# Altium project Suscoder.PrjPcb
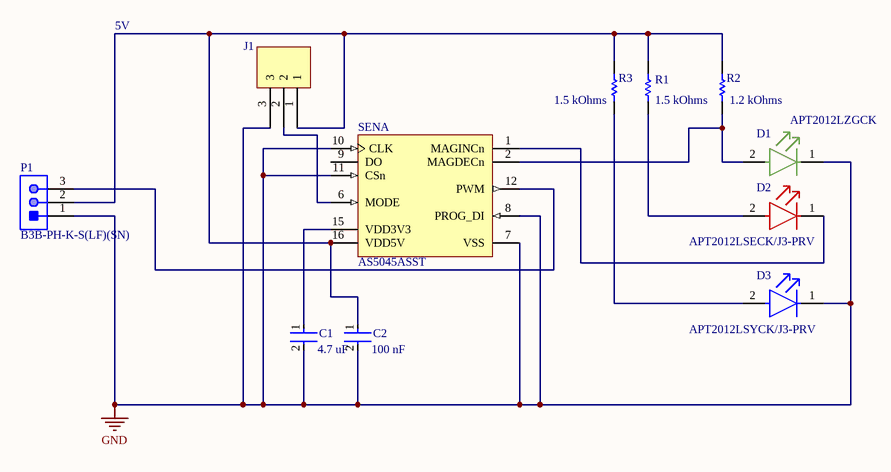
[diagram p0: SuscoderSCH.SchDoc]
1 sheet, 11 parts. Net scope: global (net labels, ports and power ports of the same name join across sheets).
Board file: SuscoderPCB.PcbDoc

## Sheet SuscoderSCH.SchDoc
size A; SheetNumber: 1; SheetTotal: 1

### Parts
C1  Capacitance: 4.7 uF  [FP-CC0805-0_85-MFG]  (hidden comment: CC0805KKX7R7BB475)
C2  Capacitance: 100 nF  [FP-CC0805-0_85-MFG]  (hidden comment: CC0805KRX7R7BB104)
D1  APT2012LZGCK  [FP-APT2012LSYCK-J3-PRV-MFG]
D2  APT2012LSECK/J3-PRV  [FP-APT2012LSYCK-J3-PRV-MFG]
D3  APT2012LSYCK/J3-PRV  [FP-APT2012LSYCK-J3-PRV-MFG]
J1  Tri-Pad Jumper  [Tri-Pad Jumper-Footprint-1]  (value not drawn)
P1  B3B-PH-K-S(LF)(SN)  [JST-B3B-PH-K-S-3_V]
R1  Resistance: 1.5 kOhms  [RESC2013X70X40ML20T20]  (hidden comment: ERJ-6ENF1501V)
R2  Resistance: 1.2 kOhms  [RESC2013X70X40ML20T20]  (hidden comment: ERJ6ENF1201V)
R3  Resistance: 1.5 kOhms  [RESC2013X70X40ML20T20]  (hidden comment: ERJ-6ENF1501V)
SEN  AS5045ASST  [AMS-SSOP-16-6200X5300DE_A_N]  (part A of 2)

### Nets
GND: C1.2 C2.2 D1.1(C) D3.1(C) J1.3 P1.1 SEN.7(VSS) SEN.8(PROG_DI) SEN.10(CLK) SEN.11(CSn)
NetC1_1: C1.1 SEN.15(VDD3V3)
NetC2_1: C2.1 J1.1 P1.2 R1.2 R2.2 R3.2 SEN.16(VDD5V)
NetD1_2: D1.2(A) R2.1 SEN.2(MAGDECn)
NetD2_1: D2.1(C) SEN.1(MAGINCn)
NetD2_2: D2.2(A) R1.1
NetD3_2: D3.2(A) R3.1
NetJ1_2: J1.2 SEN.6(MODE)
NetP1_3: P1.3 SEN.12(PWM)

Not connected (* = marked no-connect by the designer): SEN 9(DO)

### Notes on the sheet
- 5V

### Library data of the parts
C1 = CMP-03422-000207-1: CAP CER 4.7UF 16V X7R 0805; Manufacturer: Yageo; Tolerance: 0.1; Material: Ceramic; Footprint Url: http://www.yageo.com/exep/pages/download/literatures/UPY-C_GEN_24.pdf; Device Class L3: Ceramic Capacitors; Temperature: -30°C to +85°C; Device Class L2: Capacitors; Automotive: No; Digikey Description: CAP CER 4.7UF 16V X7R 0805; Temperature Range High: +85°C; Lead Free: Yes; Mouser Description: Multilayer Ceramic Capacitors MLCC - SMD/SMT 4.7M pF 10% 16 Volts; Temperature Characteristic: X7R; Height: 0.95mm; Device Class L1: Passive Components; ComponentLink2Description: Datasheet; Category: Cap; Octopart: https://octopart.com/cc0805kkx7r7bb475-yageo-34429188; Temperature Range Low: -30°C; Manufacturer Part Number: CC0805KKX7R7BB475; Package: CC0805-0.85; Ipc Land Pattern Name: CAPC200125X85; RoHS: TRUE; Value: 4.7 uF; ComponentLink2URL: http://www.yageo.com/documents/recent/UPY-GPHC_Y5V_6.3V-to-50V_8.pdf; Voltage Rating: 16 V
C2 = CMP-1036-04402-6: CAP CER 0.1UF 16V X7R 0805; Manufacturer: Yageo; Material: Ceramic; Tolerance: 0.1; Value: 100 nF; Manufacturer Part Number: CC0805KRX7R7BB104; Temperature: -30°C to +85°C; Lead Free: Yes; Footprint Url: http://www.yageo.com/exep/pages/download/literatures/UPY-C_GEN_24.pdf; Voltage Rating: 16 V; Package: CC0805-0.85; RoHS: TRUE; Digikey Description: CAP CER 0.1UF 16V X7R 0805; Category: Cap; Octopart: https://octopart.com/cc0805krx7r7bb104-yageo-39467769; Device Class L3: Ceramic Capacitors; ComponentLink2URL: http://www.yageo.com/documents/recent/UPY-GPHC_Y5V_6.3V-to-50V_8.pdf; Temperature Range Low: -30°C; Mouser Description: Multilayer Ceramic Capacitors MLCC - SMD/SMT 100nF 16V X7R 10%; Automotive: No; Device Class L2: Capacitors; Height: 0.95mm; ComponentLink2Description: Datasheet; Temperature Characteristic: X7R; Ipc Land Pattern Name: CAPC200125X85; Device Class L1: Passive Components; Temperature Range High: +85°C
D1 = CMP-007-00039-1: 2.0X1.2mm Low Current Green SMD LED; Water Clear; 525nm; 140° Viewing Angle
D2 = CMP-007-00037-1: 2.0X1.2mm Low Current Red SMD LED; Water Clear; 625nm; 140° Viewing Angle
D3 = CMP-44529-000012-1: LED YELLOW CLEAR 2SMD; Manufacturer: Kingbright; Peak Emmision Wavelength: 590nm; Luminous Intensity: 25mcd; Led Orientation: Top View; Viewing Angle: 140°; Reverse Voltage: 5V; Power Dissipation: 75mW; Forward Voltage: 1.85V; Max Junction Temp: +115°C; Forward Current: 2mA; Temperature Range Low: -40°C; Height: 0.85mm; ComponentLink2Description: Datasheet; Wavelength: 590nm; Category: Diode; Mouser Description: Standard LEDs - SMD 2.0X1.2MM LOW CRNT; RoHS: TRUE; Package: 0; Lead Free: Yes; Automotive: No; Octopart: https://octopart.com/apt2012lsyck%2Fj3-prv-kingbright-56784114; Colour: Yellow; Device Class L2: LEDs; Temperature: -40°C to +85°C; Device Class L1: Optoelectronics; Manufacturer Part Number: APT2012LSYCK/J3-PRV; ComponentLink2URL: http://www.kingbrightusa.com/images/catalog/SPEC/APT2012LSYCK-J3-PRV.pdf; Digikey Description: LED YELLOW CLEAR 2SMD; Temperature Range High: +85°C; Device Class L3: unset
J1 = CMP-00000-1: A jumper with 3 pads.
P1 = CMP-2000-05164-1: Male Header, Pitch 2 mm, 1 x 3 Position, Height 6 mm, Tail Length 3.4 mm, -25 to 85 degC, RoHS, Bulk; Manufacturer: JST; Style/Orientation: StraightHeader/Plug; Pitch: 2mm; No of Positions: 3; Termination: Crimp; Manufacturer URL: http://www.jst.com/home2.html; Datasheet Version: Oct-06; Type: ShroudedHeader; Datasheet URL: https://datasheet.ciiva.com/11746/0900766b80826550-11746939.pdf
R1 R3 = CMP-2001-04438-1: Manufacturer: Panasonic; Part Number: ERJ-6ENF1501V
R2 = CMP-2001-00512-1: Manufacturer: Panasonic; Part Number: ERJ6ENF1201V
SEN = CMP-0555-00017-2: 12 Bit Programmable Magnetic Rotary Encoder, 3.3 or 5 V, SSOP-16, Pb-Free, Reel; Manufacturer: AMS; Supply Voltage (V): 3.3 or 5.0; Resolution: 12 bit; Output: absolute serial SSI, PWM; ComponentLink1Description: Manufacturer URL; Mounting Technology: Surface Mount; PackageDescription: 16-Pin Shrink Small Outline Package, 6.2 x 5.3 mm Body, 0.65 mm Pitch; PartNumber: AS5045ASST; ComponentLink2Description: Datasheet; ComponentLink2URL: http://www.ams.com/eng/content/download/1288/7223/496; PackageVersion: Rev. 1.7, 06/2010; Features: pin-compatible to AS5040, higher resolution; ComponentLink1URL: www.ams.com; DatasheetVersion: Rev. 1.7; PackageReference: SSOP-16; Code_JEDEC: MO - 150 AC